# Altium schematic sheet SoC_Power.SchDoc
size A3; SheetNumber: 15; SheetTotal: 22
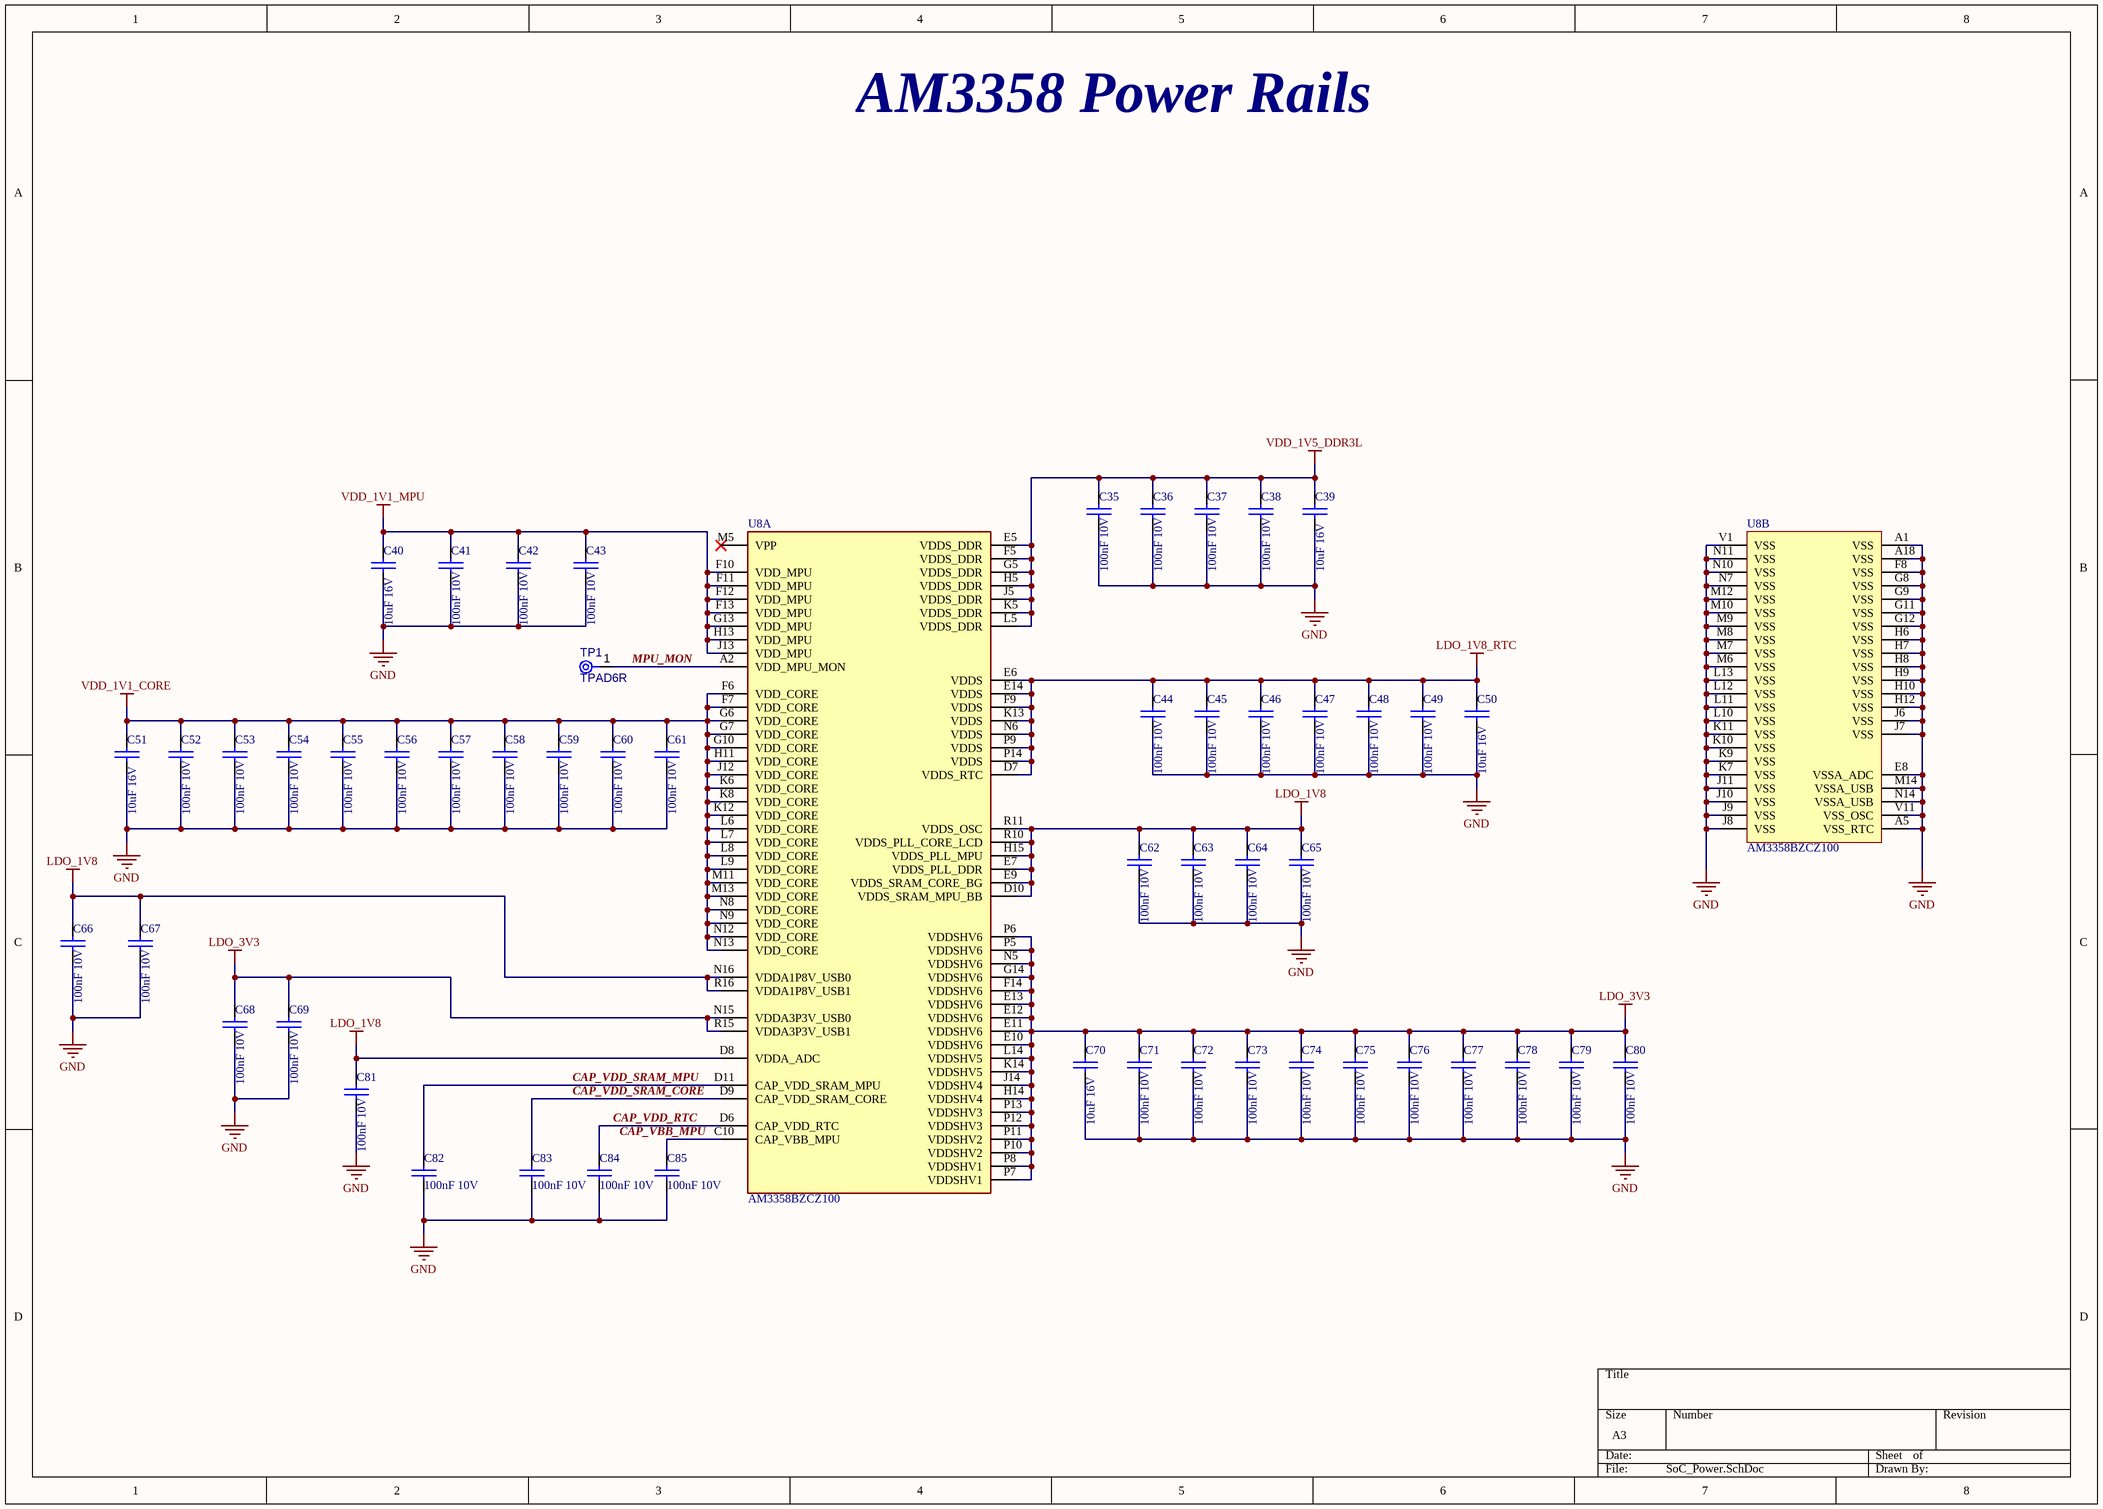
[diagram p0: SoC_Power.SchDoc]

## Parts
C35  100nF 10V  [C_0201]
C36  100nF 10V  [C_0201]
C37  100nF 10V  [C_0201]
C38  100nF 10V  [C_0201]
C39  10uF 16V  [C_0603]
C40  10uF 16V  [C_0603]
C41  100nF 10V  [C_0201]
C42  100nF 10V  [C_0201]
C43  100nF 10V  [C_0201]
C44  100nF 10V  [C_0201]
C45  100nF 10V  [C_0201]
C46  100nF 10V  [C_0201]
C47  100nF 10V  [C_0201]
C48  100nF 10V  [C_0201]
C49  100nF 10V  [C_0201]
C50  10uF 16V  [C_0603]
C51  10uF 16V  [C_0603]
C52  100nF 10V  [C_0201]
C53  100nF 10V  [C_0201]
C54  100nF 10V  [C_0201]
C55  100nF 10V  [C_0201]
C56  100nF 10V  [C_0201]
C57  100nF 10V  [C_0201]
C58  100nF 10V  [C_0201]
C59  100nF 10V  [C_0201]
C60  100nF 10V  [C_0201]
C61  100nF 10V  [C_0201]
C62  100nF 10V  [C_0201]
C63  100nF 10V  [C_0201]
C64  100nF 10V  [C_0201]
C65  100nF 10V  [C_0201]
C66  100nF 10V  [C_0201]
C67  100nF 10V  [C_0201]
C68  100nF 10V  [C_0201]
C69  100nF 10V  [C_0201]
C70  10uF 16V  [C_0603]
C71  100nF 10V  [C_0201]
C72  100nF 10V  [C_0201]
C73  100nF 10V  [C_0201]
C74  100nF 10V  [C_0201]
C75  100nF 10V  [C_0201]
C76  100nF 10V  [C_0201]
C77  100nF 10V  [C_0201]
C78  100nF 10V  [C_0201]
C79  100nF 10V  [C_0201]
C80  100nF 10V  [C_0201]
C81  100nF 10V  [C_0201]
C82  100nF 10V  [C_0201]
C83  100nF 10V  [C_0201]
C84  100nF 10V  [C_0201]
C85  100nF 10V  [C_0201]
TP1  TPAD6R  [TP06R]  (no BOM)
U8  AM3358BZCZ100  [BGA324C80P18X18_1500X1500X140]  (parts A,B of 9)

## Nets
GND: C35.2 C36.2 C37.2 C38.2 C39.2 C40.2 C41.2 C42.2 C43.2 C44.2 C45.2 C46.2 C47.2 C48.2 C49.2 C50.2 C51.2 C52.2 C53.2 C54.2 C55.2 C56.2 C57.2 C58.2 C59.2 C60.2 C61.2 C62.2 C63.2 C64.2 C65.2 C66.2 C67.2 C68.2 C69.2 C70.2 C71.2 C72.2 C73.2 C74.2 C75.2 C76.2 C77.2 C78.2 C79.2 C80.2 C81.2 C82.2 C83.2 C84.2 C85.2 U8.A1(VSS) U8.A5(VSS_RTC) U8.A18(VSS) U8.E8(VSSA_ADC) U8.F8(VSS) U8.G8(VSS) U8.G9(VSS) U8.G11(VSS) U8.G12(VSS) U8.H6(VSS) U8.H7(VSS) U8.H8(VSS) U8.H9(VSS) U8.H10(VSS) U8.H12(VSS) U8.J6(VSS) U8.J7(VSS) U8.J8(VSS) U8.J9(VSS) U8.J10(VSS) U8.J11(VSS) U8.K7(VSS) U8.K9(VSS) U8.K10(VSS) U8.K11(VSS) U8.L10(VSS) U8.L11(VSS) U8.L12(VSS) U8.L13(VSS) U8.M6(VSS) U8.M7(VSS) U8.M8(VSS) U8.M9(VSS) U8.M10(VSS) U8.M12(VSS) U8.M14(VSSA_USB) U8.N7(VSS) U8.N10(VSS) U8.N11(VSS) U8.N14(VSSA_USB) U8.V1(VSS) U8.V11(VSS_OSC)
LDO_1V8: C62.1 C63.1 C64.1 C65.1 C66.1 C67.1 C81.1 U8.D8(VDDA_ADC) U8.D10(VDDS_SRAM_MPU_BB) U8.E7(VDDS_PLL_DDR) U8.E9(VDDS_SRAM_CORE_BG) U8.H15(VDDS_PLL_MPU) U8.N16(VDDA1P8V_USB0) U8.R10(VDDS_PLL_CORE_LCD) U8.R11(VDDS_OSC) U8.R16(VDDA1P8V_USB1)
LDO_1V8_RTC: C44.1 C45.1 C46.1 C47.1 C48.1 C49.1 C50.1 U8.D7(VDDS_RTC) U8.E6(VDDS) U8.E14(VDDS) U8.F9(VDDS) U8.K13(VDDS) U8.N6(VDDS) U8.P9(VDDS) U8.P14(VDDS)
LDO_3V3: C68.1 C69.1 C70.1 C71.1 C72.1 C73.1 C74.1 C75.1 C76.1 C77.1 C78.1 C79.1 C80.1 U8.E10(VDDSHV6) U8.E11(VDDSHV6) U8.E12(VDDSHV6) U8.E13(VDDSHV6) U8.F14(VDDSHV6) U8.G14(VDDSHV6) U8.H14(VDDSHV4) U8.J14(VDDSHV4) U8.K14(VDDSHV5) U8.L14(VDDSHV5) U8.N5(VDDSHV6) U8.N15(VDDA3P3V_USB0) U8.P5(VDDSHV6) U8.P6(VDDSHV6) U8.P7(VDDSHV1) U8.P8(VDDSHV1) U8.P10(VDDSHV2) U8.P11(VDDSHV2) U8.P12(VDDSHV3) U8.P13(VDDSHV3) U8.R15(VDDA3P3V_USB1)
VDD_1V1_CORE: C51.1 C52.1 C53.1 C54.1 C55.1 C56.1 C57.1 C58.1 C59.1 C60.1 C61.1 U8.F6(VDD_CORE) U8.F7(VDD_CORE) U8.G6(VDD_CORE) U8.G7(VDD_CORE) U8.G10(VDD_CORE) U8.H11(VDD_CORE) U8.J12(VDD_CORE) U8.K6(VDD_CORE) U8.K8(VDD_CORE) U8.K12(VDD_CORE) U8.L6(VDD_CORE) U8.L7(VDD_CORE) U8.L8(VDD_CORE) U8.L9(VDD_CORE) U8.M11(VDD_CORE) U8.M13(VDD_CORE) U8.N8(VDD_CORE) U8.N9(VDD_CORE) U8.N12(VDD_CORE) U8.N13(VDD_CORE)
VDD_1V1_MPU: C40.1 C41.1 C42.1 C43.1 U8.F10(VDD_MPU) U8.F11(VDD_MPU) U8.F12(VDD_MPU) U8.F13(VDD_MPU) U8.G13(VDD_MPU) U8.H13(VDD_MPU) U8.J13(VDD_MPU)
VDD_1V5_DDR3L: C35.1 C36.1 C37.1 C38.1 C39.1 U8.E5(VDDS_DDR) U8.F5(VDDS_DDR) U8.G5(VDDS_DDR) U8.H5(VDDS_DDR) U8.J5(VDDS_DDR) U8.K5(VDDS_DDR) U8.L5(VDDS_DDR)
CAP_VBB_MPU: C85.1 U8.C10(CAP_VBB_MPU)
CAP_VDD_RTC: C84.1 U8.D6(CAP_VDD_RTC)
CAP_VDD_SRAM_CORE: C83.1 U8.D9(CAP_VDD_SRAM_CORE)
CAP_VDD_SRAM_MPU: C82.1 U8.D11(CAP_VDD_SRAM_MPU)
MPU_MON: TP1.1(TP) U8.A2(VDD_MPU_MON)

Not connected (* = marked no-connect by the designer): U8 M5(VPP)*

## Notes on the sheet
- AM3358 Power Rails

## Library data of the parts
C35-C38 C41-C49 C52-C69 C71-C85 = C_0201: Capacitor 0201 SMD
C39 C40 C50 C51 C70 = C_0603: Capacitor 0603 SMD
TP1 = CMP-00028-00002-2: 0.6mm round; Pins: 1
U8 = AM3358BZCZ100: ARM-ASeries 1GHz NFBGA-324 Microcontrollers (MCU/MPU/SOC) ROHS; Manufacturer: Texas Instruments; Manufacturer Part Number: AM3358BZCZ100; Datasheet Link: https://www.ti.com/lit/ds/symlink/am3358.pdf